# EAGLE schematic ControlBoard (EAGLE 7.5.0)
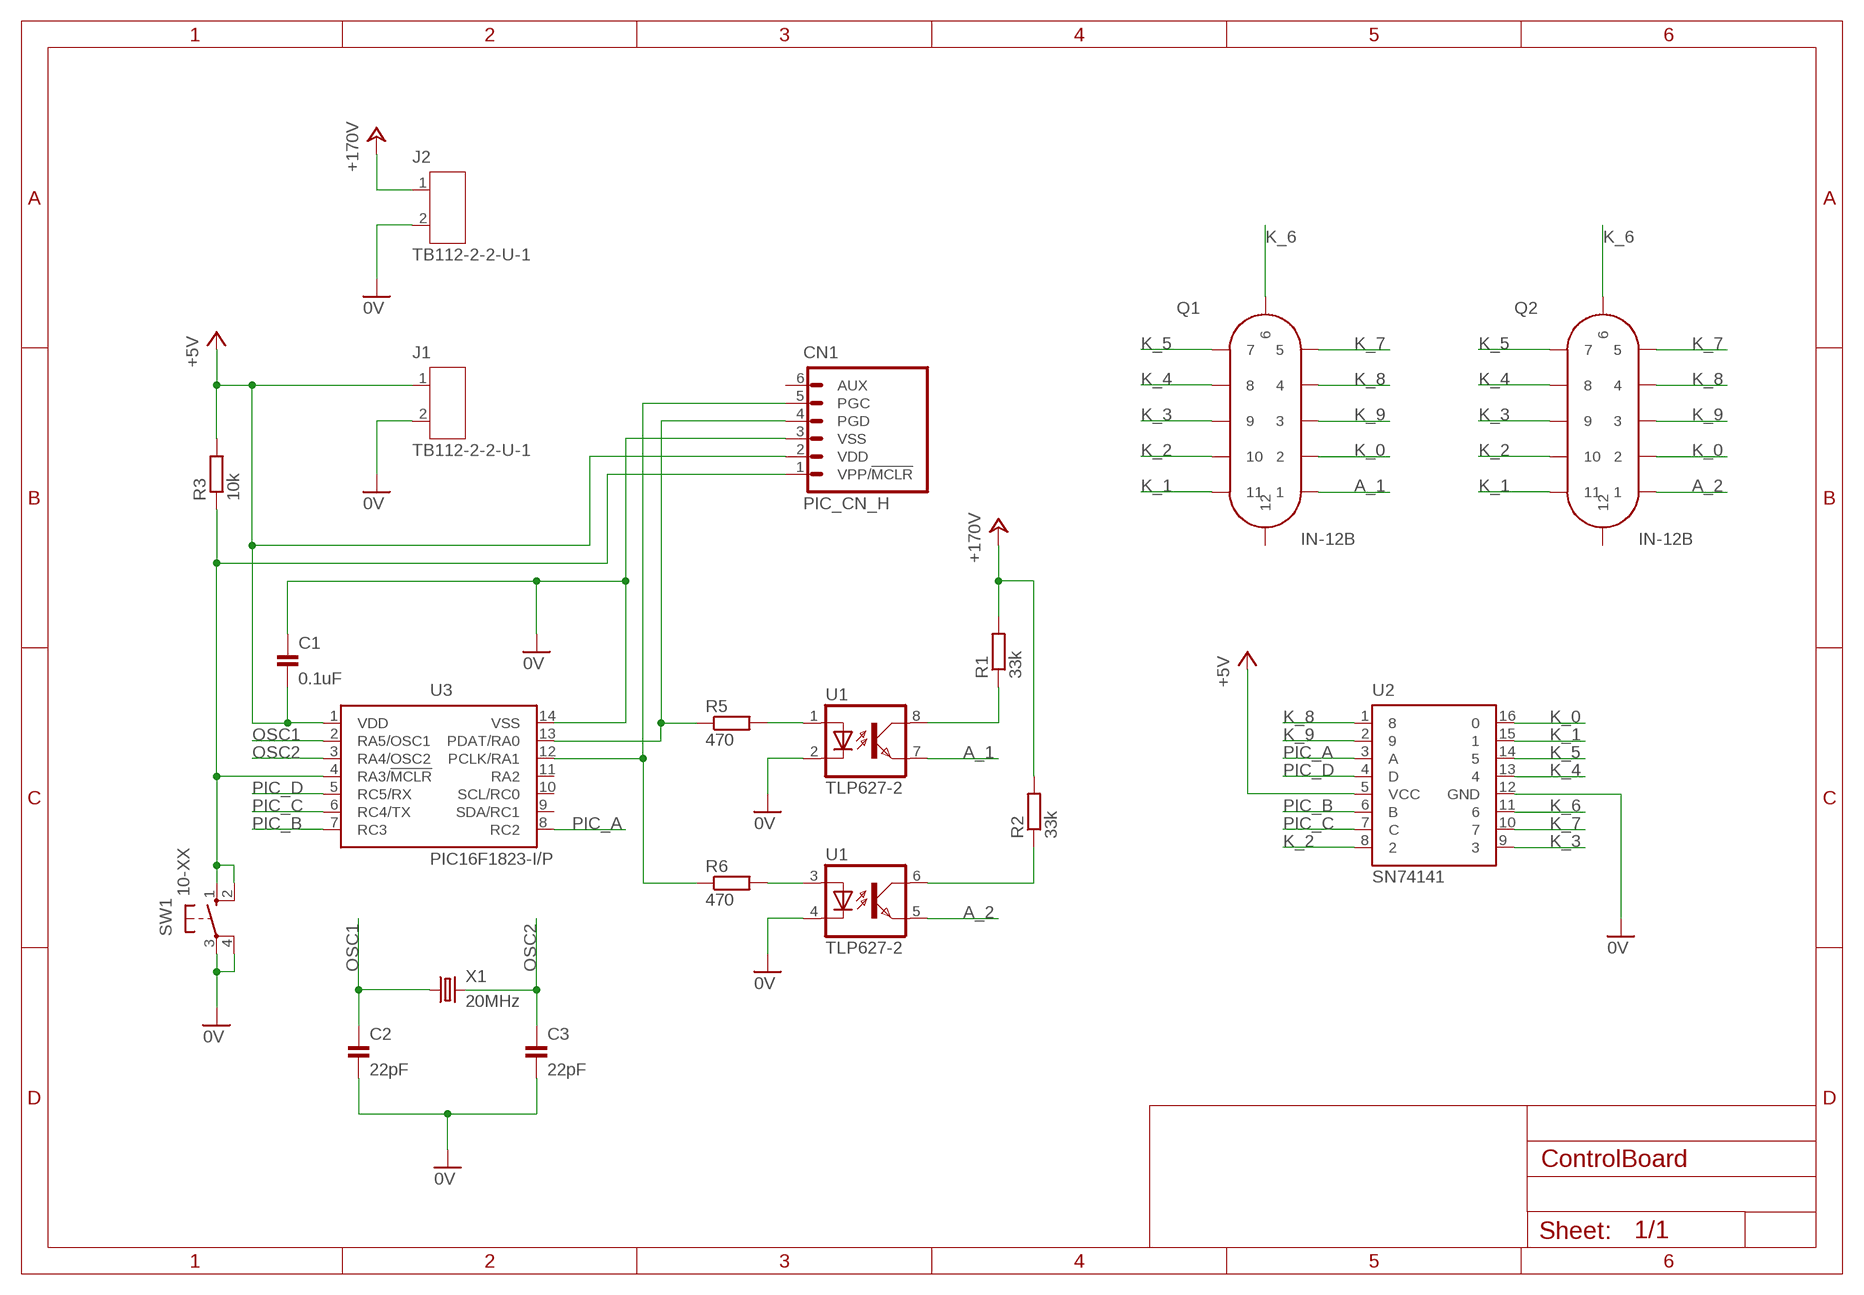
[diagram p0: schematic, sheet 1]

## Parts
C1  0.1uF  CAP_200MIL  [CAP_200MIL]
C2  22pF  CAP_100MIL  [CAP_100MIL]
C3  22pF  CAP_100MIL  [CAP_100MIL]
CN1  PIC_CN_H  [HEADER_6PIN]
J1  TB112-2-2-U-1  [TERMINAL_BLOCK_2PIN_200MIL]
J2  TB112-2-2-U-1  [TERMINAL_BLOCK_2PIN_200MIL]
Q1  IN-12B  [IN-12]
Q2  IN-12B  [IN-12]
R1  33k  RESISTOR_600MIL  [RESISTOR_0411_600MIL]
R2  33k  RESISTOR_600MIL  [RESISTOR_0411_600MIL]
R3  10k  RESISTOR_600MIL  [RESISTOR_0411_600MIL]
R5  470  RESISTOR_600MIL  [RESISTOR_0411_600MIL]
R6  470  RESISTOR_600MIL  [RESISTOR_0411_600MIL]
SW1  10-XX  [B3F-10XX]
U1  TLP627-2  [DIL08]
U2  SN74141  [DIL16]
U3  PIC16F1823-I/P  [DIL14]
X1  20MHz  HUSG-20.000-20  [HC-49/S]

## Nets
0V: C1.1 C2.2 C3.2 CN1.3(VSS) J1.2 J2.2 SW1.3(P) SW1.4(P1) U1.2(C) U1.4(C) U2.12(GND) U3.14(VSS)
+5V: C1.2 CN1.2(VDD) J1.1 R3.2 U2.5(VCC) U3.1(VDD)
+24V: J2.1 R1.2 R2.2 ; supply symbol labelled +170V
A_1: Q1.7 U1.7(EMIT)
A_2: Q2.7 U1.5(EMIT)
K_0: Q1.8 Q2.8 U2.16
K_1: Q1.5 Q2.5 U2.15
K_2: Q1.4 Q2.4 U2.8
K_3: Q1.3 Q2.3 U2.9
K_4: Q1.2 Q2.2 U2.13
K_5: Q1.1 Q2.1 U2.14
K_6: Q1.12 Q2.12 U2.11
K_7: Q1.11 Q2.11 U2.10
K_8: Q1.10 Q2.10 U2.1
K_9: Q1.9 Q2.9 U2.2
N$1: R1.1 U1.8(COL)
N$2: R2.1 U1.6(COL)
N$4: R5.2 U1.1(A)
N$5: R6.2 U1.3(A)
N$6: CN1.4(PGD) R5.1 U3.13(PDAT/RA0)
N$7: CN1.5(PGC) R6.1 U3.12(PCLK/RA1)
N$8: CN1.1(VPP/!MCLR) R3.1 SW1.1(S) SW1.2(S1) U3.4(RA3/!MCLR!)
OSC1: C2.1 U3.2(RA5/OSC1) X1.1
OSC2: C3.1 U3.3(RA4/OSC2) X1.2
PIC_A: U2.3(A) U3.8(RC2)
PIC_B: U2.6(B) U3.7(RC3)
PIC_C: U2.7(C) U3.6(RC4/TX)
PIC_D: U2.4(D) U3.5(RC5/RX)
Unconnected: CN1.6(AUX) Q1.6 Q2.6 U3.9(SDA/RC1) U3.10(SCL/RC0) U3.11(RA2)

## Library data of the parts
C1-C3 = Parts:CAP: コンデンサー
CN1 = Connectors:PIC_CN: PICKit 3 インターフェースピン
J1 J2 = Connectors:TB112-2-2-U-1: ターミナルブロック ２ピン ■ユニバーサル基板に挿せる汎用端子台 ■２ピンタイプ ■複数個連結が可能 ■寸法：９．０ｘ１０．６ｘ１２．３ｍｍ ■最大寸法：９．０ｘ１０．８ｘ１７．１ｍｍ 足の直径は約１．０ｍｍ
Q1 Q2 = Parts:IN-12*: ニキシー管
R1-R3 R5 R6 = Parts:RESISTOR: 抵抗器
SW1 = Parts:10-XX: TACT SWITCH
U1 = Parts:TLP627*: ２回路入フォトカプラ TLP627-2 ・パッケージ：８ピンＤＩＰ ・ＩＣ：１５０ｍＡ ・変換効率：４０００％ ｔｙｐ． ・動作温度：－５５℃～１００℃ ・絶縁耐圧：５０００Ｖｒｍｓ ｍｉｎ．（＠６０ｓｅｃ）
U2 = Parts:SN74141: BCD-TO-DECIMAL DECORDER/DRIVER
U3 = Parts:PIC16F1823*: 14-Pin Flash Microcontrollers ・プログラムメモリ：２Ｋワード ・ＲＡＭ：１２８バイト ・ＥＥＰＲＯＭ：２５６バイト ・Ｉ／Ｏ：最大１２本 ・ＡＤコンバータ：１０ビットｘ８ｃｈ ・コンパレータ：２ｃｈ ・タイマー：８ビットｘ２，１６ビットｘ１ ・電源電圧：１．８Ｖ（１６ＭＨｚ ＭＡＸ）～５．５Ｖ（３２ＭＨｚ ＭＡＸ） ・動作クロック：３２ＭＨｚ ＭＡＸ
X1 = Parts:HUSG-*: クリスタル（水晶発振子） 小型のＨＣ－４９／Ｓ型パッケージです。 ・２０ＭＨｚ ・負荷容量：２０ｐＦ ・周波数偏差：±３０ｐｐｍ（２５℃）